# Altium project H-Bridge_Test.PrjPcb
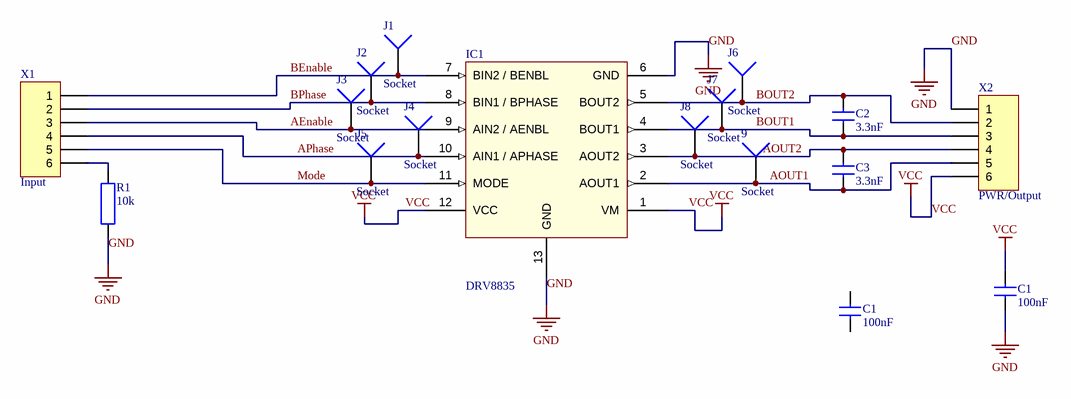
[diagram p0: H-Bridge_Test.SchDoc]
1 sheet, 17 parts. Net scope: global (net labels, ports and power ports of the same name join across sheets).
Board file: H-Bridge_Test.PcbDoc

## Sheet H-Bridge_Test.SchDoc
size A3; Organization: HSLU T&A; Address1: Abteilung Elektrotechnik; Address2: Technikumsstrasse 21; Address3: CH-6048 Horw

### Parts
(Parts that share a designator on the sheet are numbered #1, #2 ... from top to bottom, then left to right.)
9  Socket  [PIN1]
C1#1  100nF
C1#2  100nF
C2  3.3nF  [0805]
C3  3.3nF  [0805]
IC1  DRV8835  [PCBComponent_1]
J1  Socket  [PIN1]
J2  Socket  [PIN1]
J3  Socket  [PIN1]
J4  Socket  [PIN1]
J5  Socket  [PIN1]
J6  Socket  [PIN1]
J7  Socket  [PIN1]
J8  Socket  [PIN1]
R1  10k
X1  Input  [HDR1X6]
X2  PWR/Output  [HDR1X6]

### Nets
GND: C1#1.2 IC1.6(GND) IC1.13(GND) R1.1 X2.1
VCC: C1#1.1 IC1.1(VM) IC1.12(VCC) X2.6
AEnable: IC1.9(AIN2_/_AENBL) J3.1 X1.3
AOUT1: 9.1 C3.2 IC1.2(AOUT1) X2.5
AOUT2: C3.1 IC1.3(AOUT2) J8.1 X2.4
APhase: IC1.10(AIN1_/_APHASE) J4.1 X1.4
BEnable: IC1.7(BIN2_/_BENBL) J1.1 X1.1
BOUT1: C2.2 IC1.4(BOUT1) J7.1 X2.3
BOUT2: C2.1 IC1.5(BOUT2) J6.1 X2.2
BPhase: IC1.8(BIN1_/_BPHASE) J2.1 X1.2
Mode: IC1.11(MODE) J5.1 X1.5
NetR1_2: R1.2 X1.6

Not connected (* = marked no-connect by the designer): C1#2 1 2

### Notes on the sheet
- Project:
- Drawn by:
- Size:
- Sheet
- A3
- Rev.:
- of
- Date:
- File:

### Library data of the parts
C1#1 C1#2 C2 C3 = C?: Normaler Kondensator
R1 = R?: Normaler Widerstand
X1 X2 = MHDR1X6: Header, 6-Pin; LatestRevisionDate: 17-Jul-2002; LatestRevisionNote: Re-released for DXP Platform.; Publisher: Altium Limited
9 J1-J8 = Socket: LatestRevisionDate: 17-Jul-2002; LatestRevisionNote: Re-released for DXP Platform.; Publisher: Altium Limited